# EAGLE schematic ADCMP607-step-gen-v2 (EAGLE 9.4.1)
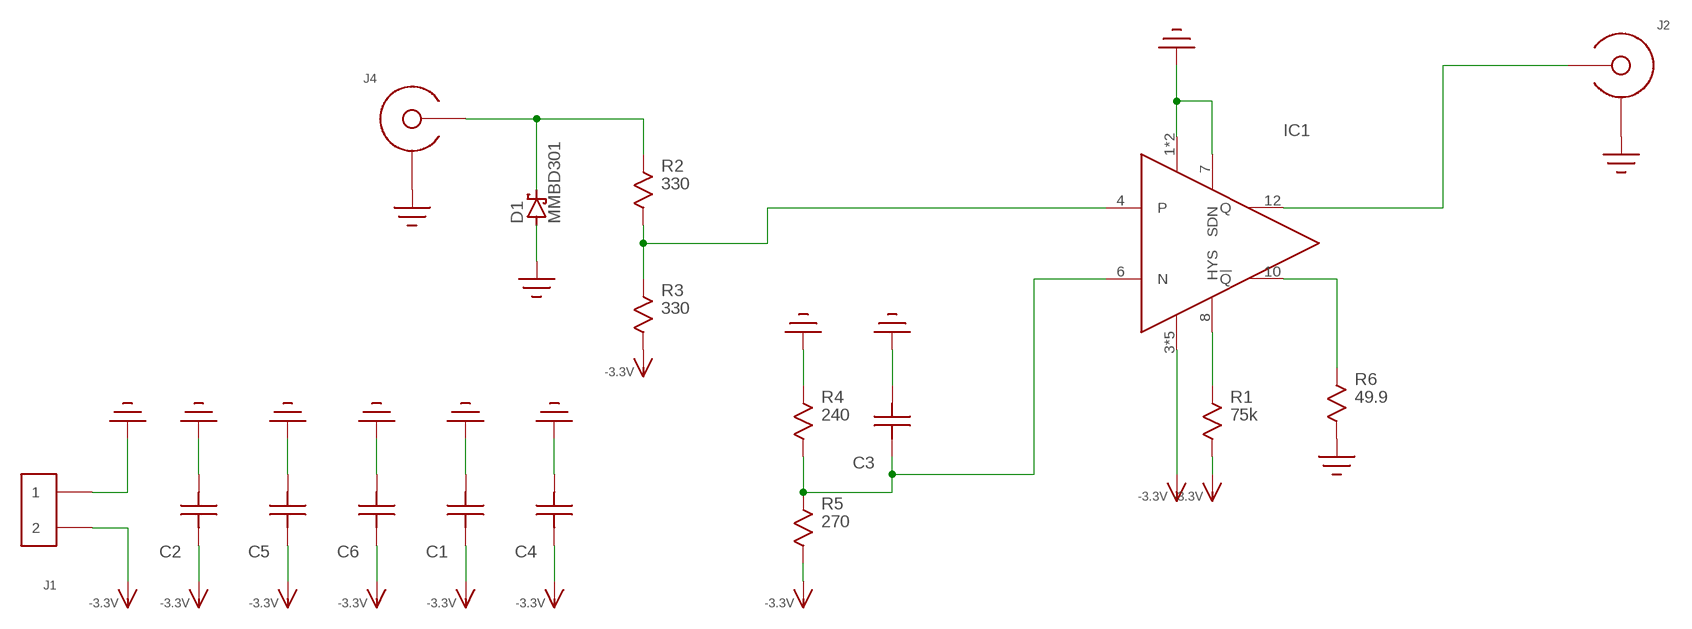
[diagram p0: schematic, sheet 1]

## Parts
C1  C0603  [C0603]
C2  C1206  [1206]
C3  C0603  [C0603]
C4  C0603  [C0603]
C5  C0603  [C0603]
C6  C0603  [C0603]
D1  MMBD301  SCHOTTKY  [SOT-23]
IC1  ADCMP607  [QFN12-3X3]
J1  HEADER_2PIN  [HEADER_2PIN]
J2  SMA-EDGE-LAUNCH4020_TAPER  [SMA_EDGE_LAUNCH_2L_4020_TAPER]
J4  SMA-EDGE-LAUNCH4020_TAPER  [SMA_EDGE_LAUNCH_2L_4020_TAPER]
R1  75k  R0603  [R0603]
R2  330  R0603  [R0603]
R3  330  R0603  [R0603]
R4  240  R0603  [R0603]
R5  270  R0603  [R0603]
R6  49.9  R0603  [R0603]

## Nets
-3.3V: C1.P$2 C2.P$2 C4.P$2 C5.P$2 C6.P$2 IC1.3(VEE) IC1.5(VEE) IC1.9(VEE) IC1.11(VEE) IC1.EP(VEE) J1.2 R1.P$2 R3.P$2 R5.P$2
GND: C1.P$1 C2.P$1 C3.P$1 C4.P$1 C5.P$1 C6.P$1 D1.1(A) IC1.1(VCC) IC1.2(VCC) IC1.7(SDN) J1.1 J2.BOTTOM_GND(SHIELD) J2.GND@1(SHIELD) J2.GND@2(SHIELD) J2.GND@3(SHIELD) J2.GND@4(SHIELD) J2.GND@5(SHIELD) J2.GND@6(SHIELD) J2.GND@7(SHIELD) J2.GND@8(SHIELD) J2.GND@14(SHIELD) J2.GND@15(SHIELD) J2.GND@16(SHIELD) J2.GND@17(SHIELD) J2.GND_PAD1(SHIELD) J2.GND_PAD2(SHIELD) J2.P$1(SHIELD) J2.P$2(SHIELD) J4.BOTTOM_GND(SHIELD) J4.GND@1(SHIELD) J4.GND@2(SHIELD) J4.GND@3(SHIELD) J4.GND@4(SHIELD) J4.GND@5(SHIELD) J4.GND@6(SHIELD) J4.GND@7(SHIELD) J4.GND@8(SHIELD) J4.GND@14(SHIELD) J4.GND@15(SHIELD) J4.GND@16(SHIELD) J4.GND@17(SHIELD) J4.GND_PAD1(SHIELD) J4.GND_PAD2(SHIELD) J4.P$1(SHIELD) J4.P$2(SHIELD) R4.P$1 R6.P$2
N$1: C3.P$2 IC1.6(N) R4.P$2 R5.P$1
N$2: IC1.8(HYS) R1.P$1
N$3 [29-6]: IC1.12(Q) J2.CENTER@1(CENTER)
N$4 [29-6]: IC1.10(!Q!) R6.P$1
N$5 [29-6]: D1.3(C) J4.CENTER@1(CENTER) R2.P$1
N$6 [29-6]: IC1.4(P) R2.P$2 R3.P$1

## Library data of the parts
C1-C6 = yapo:C
D1 = yapo:SCHOTTKY
IC1 = yapo:ADCMP607
J1 = yapo:HEADER_2PIN
J2 J4 = yapo:SMA-EDGE-LAUNCH
R1-R6 = yapo:R

## Net classes
1 29-6: width 0.737 mm, clearance 0.152 mm